# Altium schematic sheet TI_FREQ.SchDoc
size A4
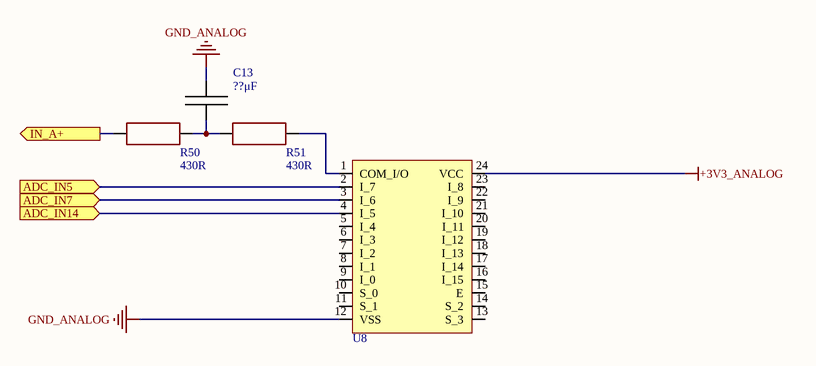
[diagram p0: TI_FREQ.SchDoc]

## Parts
C13  value ??μF  [CAP: 0603]  (hidden comment: Cap_0603)
R50  value 430R  [RES: 0603]  (hidden comment: Resistor_0603)
R51  value 430R  [RES: 0603]  (hidden comment: Resistor_0603)
U8  CD74HC4067M96  [SOIC-24]  (value not drawn)

## Ports
ADC_IN5 (in), ADC_IN7 (in), ADC_IN14 (in), IN_A+ (out)

## Nets
+3V3_ANALOG: U8.24(VCC)
GND_ANALOG: C13.2 U8.12(VSS)
ADC_IN5: U8.2(I_7) ; port ADC_IN5
ADC_IN7: U8.3(I_6) ; port ADC_IN7
ADC_IN14: U8.4(I_5) ; port ADC_IN14
IN_A+: R50.1 ; port IN_A+
NetC13_1: C13.1 R50.2 R51.1
NetR51_2: R51.2 U8.1(COM_I/O)

Not connected (* = marked no-connect by the designer): U8 5(I_4) 6(I_3) 7(I_2) 8(I_1) 9(I_0) 10(S_0) 11(S_1) 13(S_3) 14(S_2) 15(E) 16(I_15) 17(I_14) 18(I_13) 19(I_12) 20(I_11) 21(I_10) 22(I_9) 23(I_8)

## Library data of the parts
C13 = Cap_0603: TypeDielectric: X7R(X5R); Voltage: ??V; Package/Case: 0603; Temperature: -55...+125°C(-55...+85°C); Product Category: Capacitors
R50 R51 = Resistor_0603: Power: 0.1W; Tolerance: ±5%; Package/Case: 0603; Temperature: -55...+125°C; Product Category: Resistors
U8 = CD74HC4067M96: 1 MHz, Low-Power Op Amp; Manufacturer: Texas Instruments; Datasheet: https://www.ti.com/general/docs/suppproductinfo.tsp?distId=26&gotoUrl=https://www.ti.com/lit/gpn/cd74hct4067; HelpURL: https://eu.mouser.com/ProductDetail/Texas-Instruments/CD74HC4067M96?qs=xFfolx0DHx0XT7d9xTTZBA%3D%3D; Package/Case: SOIC-24; Product Category: Multiplexers